# Altium schematic sheet AUAV_X05_IMU.SchDoc
size A4
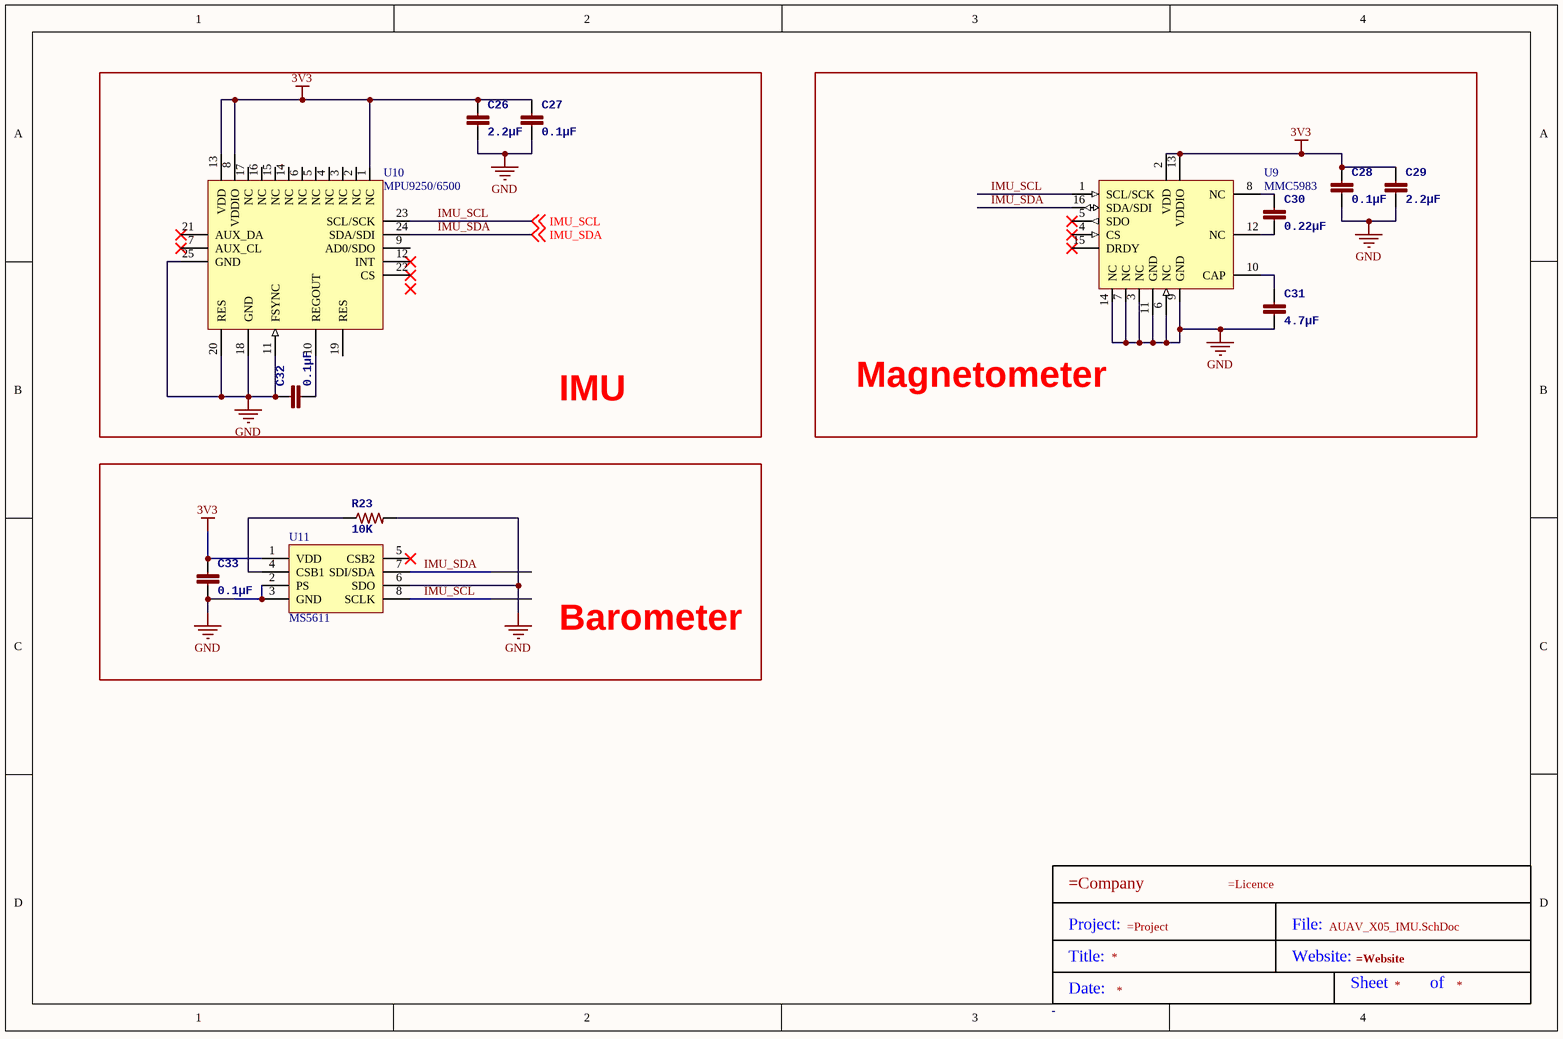
[diagram p0: AUAV_X05_IMU.SchDoc]

## Parts
*?  Title Block  (value not drawn)
C26  2.2µF  [0402-CAP]
C27  0.1µF  [0402-CAP]
C28  0.1µF  [0402-CAP]
C29  2.2µF  [0402-CAP]
C30  0.22µF  [0402-CAP]
C31  4.7µF  [0603-CAP]
C32  0.1µF  [0402-CAP]
C33  0.1µF  [0402-CAP]
R23  10K  [0402-RES]
U9  MMC5983  [MMC5983]
U10  MPU9250/6500  [QFN24_3X3X1_IVS]
U11  MS5611  [MS5611-01BA]

## Blocks framed on the sheet
IMU: C26 C27 C32 U10
Magnetometer: C28-C31 U9
Barometer: C33 R23 U11

## Nets
3V3: C26.P$1 C27.P$1 C28.P$1 C29.P$1 C33.P$1 U9.2(VDD) U9.13(VDDIO) U10.1(NC) U10.8(VDDIO) U10.13(VDD) U11.1(VDD)
GND: C26.P$2 C27.P$2 C28.P$2 C29.P$2 C31.P$2 C32.P$1 C33.P$2 R23.P$2 U9.3(NC) U9.6(NC) U9.7(NC) U9.9(GND) U9.11(GND) U9.14(NC) U10.11(FSYNC) U10.18(GND) U10.20(RES) U10.25(GND) U11.2(PS) U11.3(GND) U11.6(SDO)
IMU_SCL: U9.1(SCL/SCK) U10.23(SCL/SCK) U11.8(SCLK) ; off-sheet IMU_SCL
IMU_SDA: U9.16(SDA/SDI) U10.24(SDA/SDI) U11.7(SDI/SDA) ; off-sheet IMU_SDA
NetC30_P$1: C30.P$1 U9.8(NC)
NetC30_P$2: C30.P$2 U9.12(NC)
NetC31_P$1: C31.P$1 U9.10(CAP)
NetC32_P$2: C32.P$2 U10.10(REGOUT)
NetR23_P$1: R23.P$1 U11.4(CSB1)

Not connected (* = marked no-connect by the designer): U9 4(CS)* 5(SDO)* 15(DRDY)*; U10 2(NC) 3(NC) 4(NC) 5(NC) 6(NC) 7(AUX_CL)* 9(AD0/SDO) 12(INT)* 14(NC) 15(NC) 16(NC) 17(NC) 19(RES) 21(AUX_DA)* 22(CS)*; U11 5(CSB2)*

## Notes on the sheet
- (in symbol Title Block) Project:; File:; Title:; Website:; Sheet; of; Date:

## Library data of the parts
C26-C30 C32 C33 = CAP0402: CAP CER 8PF 50V C0G 0402; PARTNO: C1005C0G1H080C; 3DR_PARTNO: ECM0710; Value: 8p; Supplier 1: Digi-Key; Supplier Part Number 1: 445-4890-1-ND
C31 = CAP0603: CAP CER 2.2UF 16V 10% X6S 0603; PARTNO: C1608X6S1C225K080AC; 3DR_PARTNO: ECM0619; Value: 2u2; Supplier 1: Digi-Key; Supplier Part Number 1: 445-7438-1-ND
R23 = RESISTOR0402-RES: RES 10K OHM 1/16W 1% 0402 SMD; PARTNO: RC0402FR-0710KL; 3DR_PARTNO: ECM0800; Supplier 1: Digi-Key; Value: 10K; Supplier Part Number 1: 311-10.0KLRCT-ND
U10 = MPU6500
U11 = MS5611-01BA03
*? = Title Block: Size: -